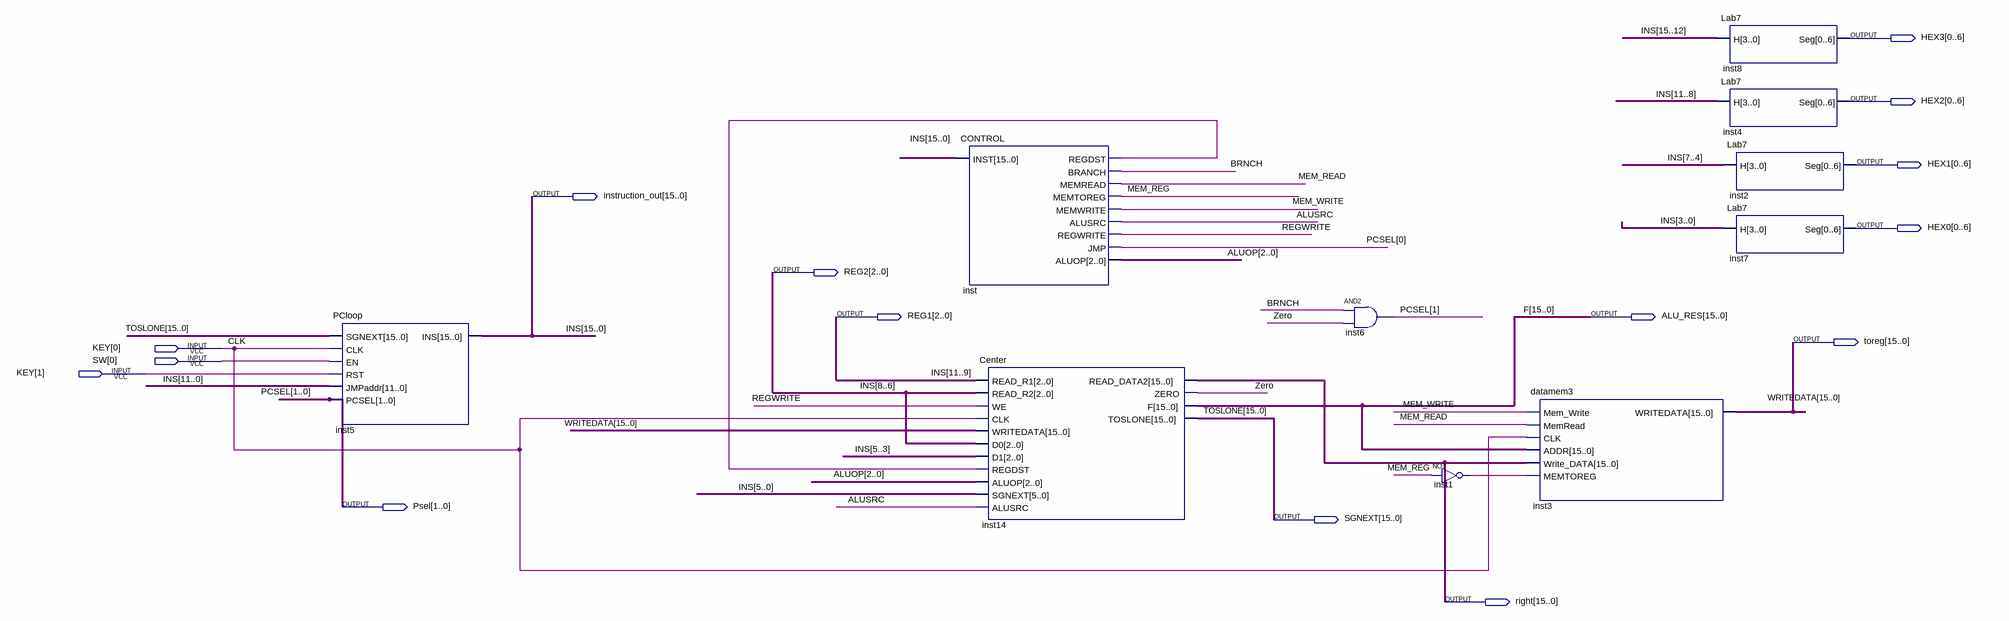
[diagram p0: schematic sheet]
// Quartus schematic MIPS_SCHEMATIC.bdf as structural Verilog: 10 symbols, 15 pins
module MIPS_SCHEMATIC (
  input  [1:0] KEY,
  input  [0:0] SW,
  output [0:6] HEX3,
  output [0:6] HEX2,
  output [0:6] HEX1,
  output [15:0] instruction_out,
  output [0:6] HEX0,
  output [2:0] REG2,
  output [2:0] REG1,
  output [15:0] ALU_RES,
  output [15:0] toreg,
  output [1:0] Psel,
  output [15:0] SGNEXT,
  output [15:0] right
);

  wire ALUSRC, BRNCH, inst1_out, inst_regdst, MEM_READ, MEM_REG, MEM_WRITE, REGWRITE, Zero;
  wire [2:0] ALUOP;

  PCloop inst5 (
    .SGNEXT(SGNEXT), .CLK(KEY[0]), .EN(SW[0]), .RST(KEY[1]), .JMPaddr(instruction_out[11:0]), .PCSEL(Psel),
    .INS(instruction_out));
  CONTROL inst (
    .INST(instruction_out), .REGDST(inst_regdst), .BRANCH(BRNCH), .MEMREAD(MEM_READ), .MEMTOREG(MEM_REG),
    .MEMWRITE(MEM_WRITE), .ALUSRC(ALUSRC), .REGWRITE(REGWRITE), .JMP(Psel[0]), .ALUOP(ALUOP));
  Center inst14 (
    .READ_R1(instruction_out[11:9]), .READ_R2(instruction_out[8:6]), .WE(REGWRITE), .CLK(KEY[0]),
    .WRITEDATA(toreg), .D0(instruction_out[8:6]), .D1(instruction_out[5:3]), .REGDST(inst_regdst),
    .ALUOP(ALUOP), .SGNEXT(instruction_out[5:0]), .ALUSRC(ALUSRC), .READ_DATA2(right), .ZERO(Zero),
    .F(ALU_RES), .TOSLONE(SGNEXT));
  and inst6 (Psel[1], BRNCH, Zero);
  not inst1 (inst1_out, MEM_REG);
  datamem3 inst3 (
    .Mem_Write(MEM_WRITE), .MemRead(MEM_READ), .CLK(KEY[0]), .ADDR(ALU_RES), .Write_DATA(right),
    .MEMTOREG(inst1_out), .WRITEDATA(toreg));
  Lab7 inst8 (.H(instruction_out[15:12]), .Seg(HEX3));
  Lab7 inst4 (.H(instruction_out[11:8]), .Seg(HEX2));
  Lab7 inst2 (.H(instruction_out[7:4]), .Seg(HEX1));
  Lab7 inst7 (.H(instruction_out[3:0]), .Seg(HEX0));

  assign REG1 = instruction_out[11:9];
  assign REG2 = instruction_out[8:6];

  // Other names for the same wires on the sheet: F[15:0] = ALU_RES; INS[15:0] = instruction_out; CLK = KEY[0];
  //   PCSEL[1:0] = Psel; TOSLONE[15:0] = SGNEXT; WRITEDATA[15:0] = toreg
endmodule
